# Altium project CH340G.PrjPCB
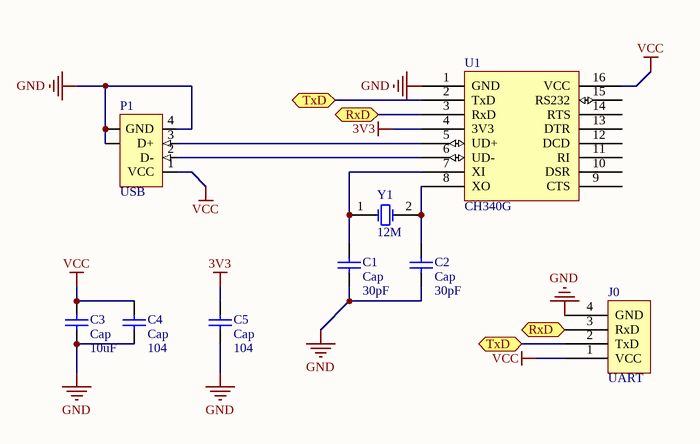
[diagram p0: CH340G.SchDoc]
1 sheet, 9 parts. Net scope: flat (ports and power ports of the same name join across sheets).
Board file: CH340G.PcbDoc

## Sheet CH340G.SchDoc
size A4

### Parts
C1  Cap  value 30pF  [C0805]
C2  Cap  value 30pF  [C0805]
C3  Cap  value 10uF  [C0805]
C4  Cap  value 104  [C0805]
C5  Cap  value 104  [C0805]
J0  UART  [SIP4-2.54]
P1  USB  [USB01]
U1  CH340G  [SOP16]
Y1  12M  [X-HC-49S]

### Ports
RxD (bidir), TxD (bidir)

### Nets
3V3: C5.2 U1.4(3V3)
GND: C1.1 C2.1 C3.1 C4.1 C5.1 J0.4(GND) P1.4(GND) P1.5(SHLD) P1.6(SHLD) U1.1(GND)
VCC: C3.2 C4.2 J0.1(VCC) P1.1(VCC) U1.16(VCC)
NetC1_2: C1.2 U1.7(XI) Y1.1(OSC1)
NetC2_2: C2.2 U1.8(XO) Y1.2(OSC2)
NetJ0_2: J0.2(TxD) U1.2(TxD) ; port TxD
NetJ0_3: J0.3(RxD) U1.3(RxD) ; port RxD
NetP1_2: P1.2(D-) U1.6(UD-)
NetP1_3: P1.3(D+) U1.5(UD+)

Not connected (* = marked no-connect by the designer): U1 9(CTS) 10(DSR) 11(RI) 12(DCD) 13(DTR) 14(RTS) 15(RS232)

### Library data of the parts
C1-C5 = Cap: Capacitor; Published: 8-Jun-2000; LatestRevisionDate: 17-Jul-2002; LatestRevisionNote: Re-released for DXP Platform.; PackageReference: RAD-0.3; Publisher: Altium Limited; PackageDescription: Radial Cap, Thru-Hole; 2 Leads; 0.3 in Pin Spacing
P1 = USB: USB 1.1, Right Angle, SMT, A Type, Plug, 4 Position, Natural; ContactMaterial: Brass; ContactPlating: Gold (30) over Nickel (50); PCB_Layout: Complies with manufacturer's recommendation.; DrillSize: Corresponds to nominal value.; PanelGround: Without; Published: 15-Jul-2004; DatasheetDocument: 21-Jan-2003; PackageDocument: 21-Jan-2003; PackageReference: 1470695A; Publisher: Altium Limited; HousingMaterial: Thermoplastic; ComponentLink1Description: Manufacturer Link; ComponentLink1URL: http://www.tycoelectronics.com/; ComponentLink2Description: Packaging Specification; ComponentLink2URL: http://ecommas.tycoelectronics.com/commerce/DocumentDelivery/DDEController?Action=showdoc&DocId=Customer+Drawing%7F1470695%7FO%7Fpdf%7FEnglish%7FC_1470695_O.pdf
Y1 = XTAL: Crystal Oscillator; Published: 8-Jun-2000; LatestRevisionDate: 17-Jul-2002; LatestRevisionNote: Re-released for DXP Platform.; PackageReference: R38; Publisher: Altium Limited; PackageDescription: Crystal, Thru-Hole; 2 Leads; Body 3.1 x 8.2 mm (Dia.xH)